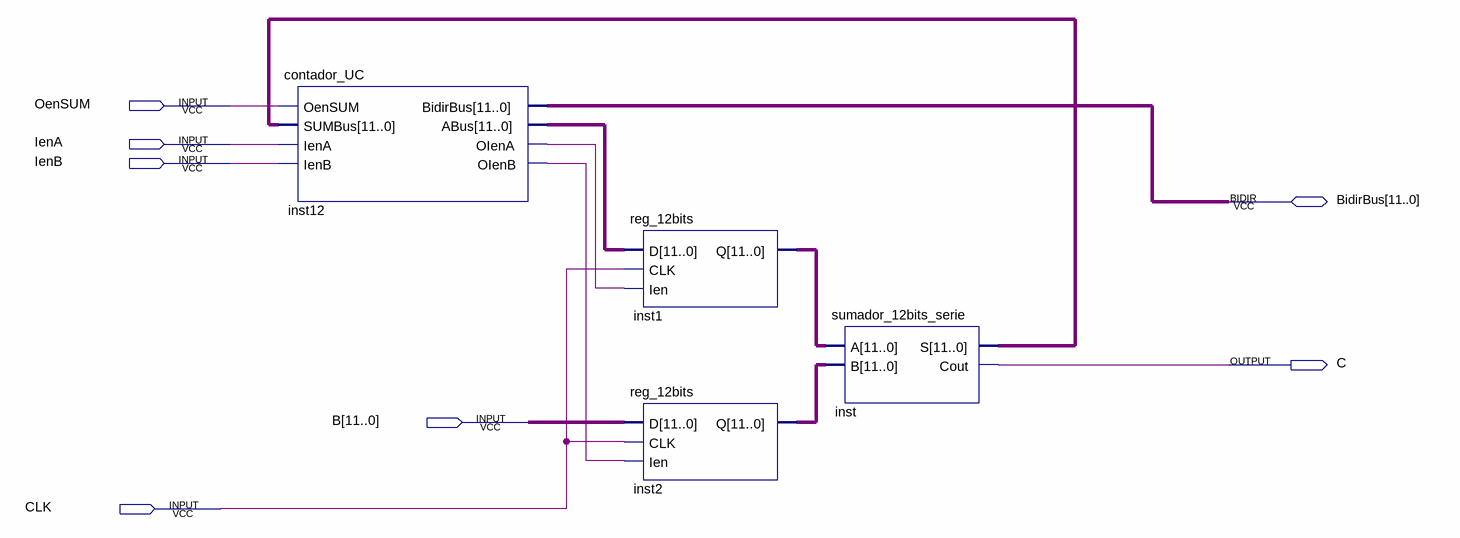
[diagram p0: schematic sheet]
// Quartus schematic contador.bdf as structural Verilog: 4 symbols, 7 pins
module contador (
  input  OenSUM,
  input  IenA,
  input  IenB,
  input  [11:0] B,
  input  CLK,
  inout  [11:0] BidirBus,
  output C
);

  wire inst12_oiena, inst12_oienb;
  wire [11:0] inst1_q, inst2_q, inst12_abus, inst_s;

  contador_UC inst12 (
    .OenSUM(OenSUM), .SUMBus(inst_s), .IenA(IenA), .IenB(IenB), .ABus(inst12_abus), .OIenA(inst12_oiena),
    .OIenB(inst12_oienb), .BidirBus(BidirBus));
  reg_12bits inst1 (.D(inst12_abus), .CLK(CLK), .Ien(inst12_oiena), .Q(inst1_q));
  reg_12bits inst2 (.D(B), .CLK(CLK), .Ien(inst12_oienb), .Q(inst2_q));
  sumador_12bits_serie inst (.A(inst1_q), .B(inst2_q), .S(inst_s), .Cout(C));
endmodule
